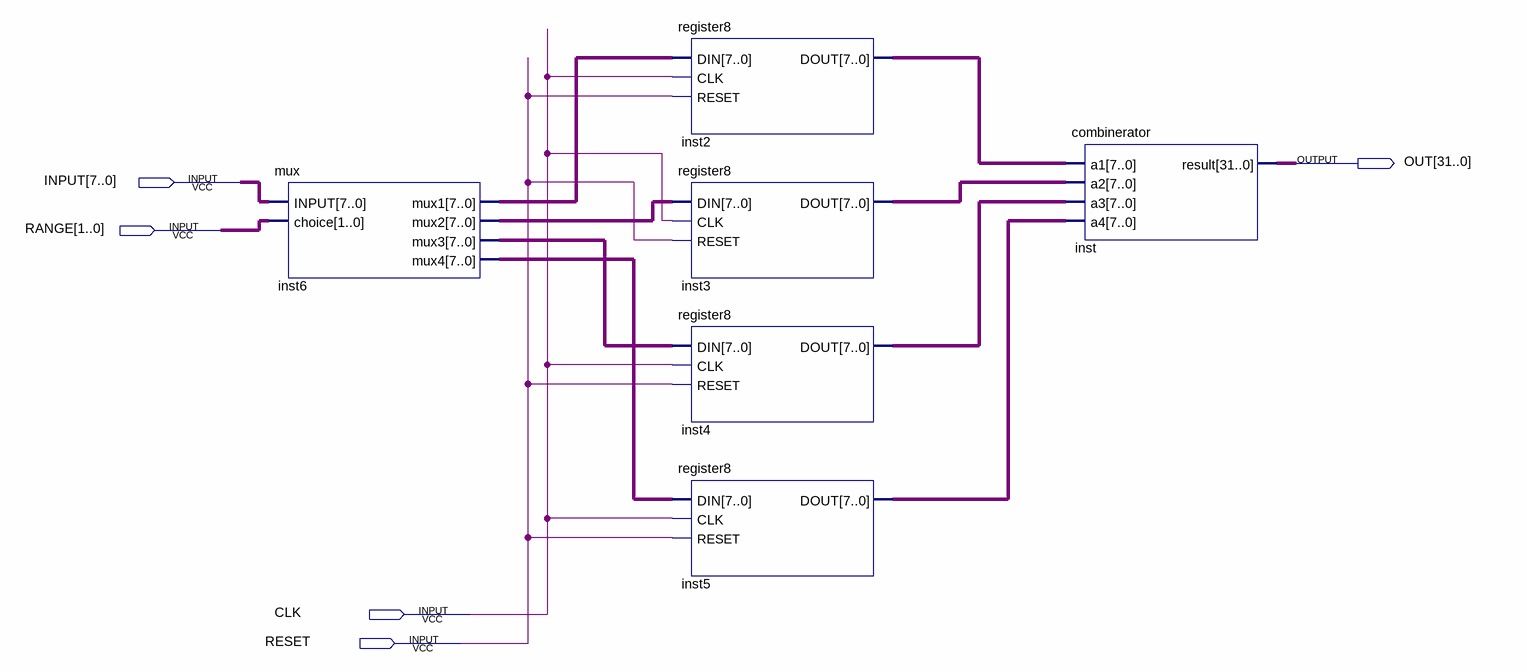
[diagram p0: schematic sheet]
// Quartus schematic inputBuffer.bdf as structural Verilog: 6 symbols, 5 pins
module inputBuffer (
  input  [7:0] INPUT,
  input  [1:0] RANGE,
  input  CLK,
  input  RESET,
  output [31:0] OUT
);

  wire [7:0] inst2_dout, inst3_dout, inst4_dout, inst5_dout, inst6_mux1, inst6_mux2, inst6_mux3, inst6_mux4;

  mux inst6 (.INPUT(INPUT), .choice(RANGE), .mux1(inst6_mux1), .mux2(inst6_mux2), .mux3(inst6_mux3), .mux4(inst6_mux4));
  register8 inst2 (.DIN(inst6_mux1), .CLK(CLK), .RESET(RESET), .DOUT(inst2_dout));
  register8 inst3 (.DIN(inst6_mux2), .CLK(CLK), .RESET(RESET), .DOUT(inst3_dout));
  register8 inst4 (.DIN(inst6_mux3), .CLK(CLK), .RESET(RESET), .DOUT(inst4_dout));
  register8 inst5 (.DIN(inst6_mux4), .CLK(CLK), .RESET(RESET), .DOUT(inst5_dout));
  combinerator inst (.a1(inst2_dout), .a2(inst3_dout), .a3(inst4_dout), .a4(inst5_dout), .result(OUT));
endmodule
